# EAGLE design BEP2_rev1 (EAGLE 6.5.0)
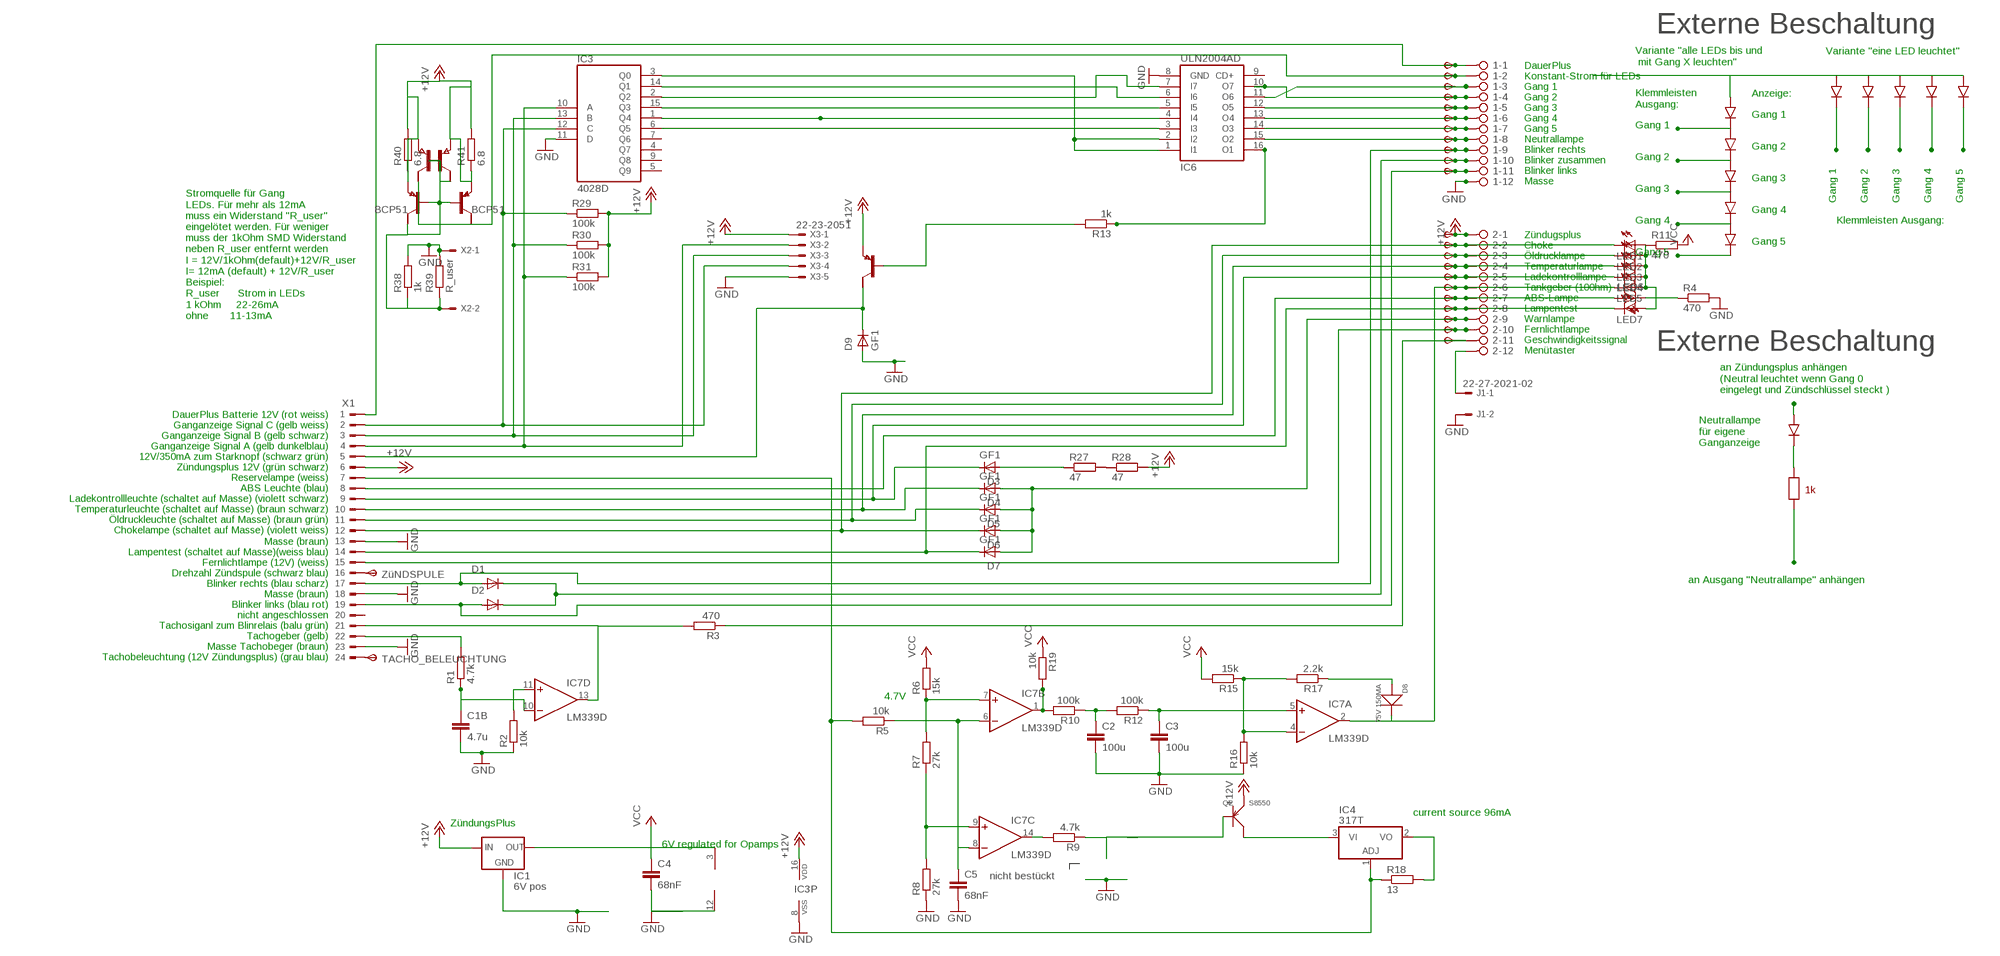
[diagram p0: schematic, sheet 1]

## Parts
1  2081-1132  [12-PIN]
2  2081-1132  [12-PIN]
C1B  4.7u  C-EUC0805K  [C0805K]
C2  100u  C-EUC1206K  [C1206K]
C3  100u  C-EUC1206K  [C1206K]
C4  68nF  C-EUC1206K  [C1206K]
C5  68nF  C-EUC1206K  [C1206K]
D1  GF1  [SMA-DO214AC]
D2  GF1  [SMA-DO214AC]
D3  GF1  [SMA-DO214AC]
D4  GF1  [SMA-DO214AC]
D5  GF1  [SMA-DO214AC]
D6  GF1  [SMA-DO214AC]
D7  GF1  [SMA-DO214AC]
D8  75V 150MA  SMD-DIODE-SWITCHING-75V-150MA(D1206)  [LED-1206]
D9  GF1  [SMA-DO214AC]
IC1  6V pos  78LXX  [78LXX]
IC3  4028D  [SO16]
IC4  317T  [TO220H]
IC6  ULN2004AD  [SO16]
IC7  LM339D  [SO14]
J1  22-27-2021-02  [6410-02]
LED1  LEDLD260  [LD260]
LED2  LEDLD260  [LD260]
LED3  LEDLD260  [LD260]
LED4  LEDLD260  [LD260]
LED5  LEDLD260  [LD260]
LED6  LEDLD260  [LD260]
LED7  LEDLD260  [LD260]
Q2  S8550  SMD-TRANSISTORS-PNP-25V-500MA-S8550(SOT-23)  [SOT-23]
Q3  BCP53T1  [SOT223]
R1  4.7k  R-EU_R0805  [R0805]
R2  10k  R-EU_R0805  [R0805]
R3  470  R-EU_R0805  [R0805]
R4  470  R-EU_R0805  [R0805]
R5  10k  R-EU_R0805  [R0805]
R6  15k  R-EU_R0805  [R0805]
R7  27k  R-EU_R0805  [R0805]
R8  27k  R-EU_R0805  [R0805]
R9  4.7k  R-EU_R0805  [R0805]
R10  100k  R-EU_R0805  [R0805]
R11  470  R-EU_R0805  [R0805]
R12  100k  R-EU_R0805  [R0805]
R13  1k  R-EU_R0805  [R0805]
R15  15k  R-EU_R0805  [R0805]
R16  10k  R-EU_R0805  [R0805]
R17  2.2k  R-EU_R0805  [R0805]
R18  13  R-EU_R1206  [R1206]
R19  10k  R-EU_R0805  [R0805]
R27  47  R-EU_V235/17_1MM  [V235/17_1MM]
R28  47  R-EU_V235/17_1MM  [V235/17_1MM]
R29  100k  R-EU_R0805  [R0805]
R30  100k  R-EU_R0805  [R0805]
R31  100k  R-EU_R0805  [R0805]
R38  1k  R-EU_R0805  [R0805]
R39  R_user  R-EU_R0805  [R0805]
R40  6.8  R-EU_R0805  [R0805]
R41  6.8  R-EU_R0805  [R0805]
T1  PNP2SM8  [SM8]
T13  BCP53T1  [SOT223]
T14  BCP53T1  [SOT223]
TACHO_BELEUCHTUNG  TPSP1_1MM  [P1_1.0MM]
TP1  TPSB1,27  [B1,27]
TP2  TPSB1,27  [B1,27]
TP3  TPSB1,27  [B1,27]
TP4  TPSB1,27  [B1,27]
TP5  TPSB1,27  [B1,27]
TP6  TPSB1,27  [B1,27]
TP7  TPSB1,27  [B1,27]
TP8  TPSB1,27  [B1,27]
TP9  TPSB1,27  [B1,27]
TP10  TPSB1,27  [B1,27]
TP11  TPSB1,27  [B1,27]
TP12  TPSB1,27  [B1,27]
TP16  TPSB1,27  [B1,27]
TP17  TPSB1,27  [B1,27]
TP18  TPSB1,27  [B1,27]
TP19  TPSB1,27  [B1,27]
TP21  TPSB1,27  [B1,27]
TP22  TPSB1,27  [B1,27]
TP23  TPSB1,27  [B1,27]
TP24  TPSB1,27  [B1,27]
TP25  TPSB1,27  [B1,27]
TP26  TPSB1,27  [B1,27]
X1  CON_BMW  [24-PIN]
X2  22-23-2021  [22-23-2021]
X3  22-23-2051  [22-23-2051]
ZüNDSPULE  TPSP1_1MM  [P1_1.0MM]

## Nets
+12V: 2.1 IC1.IN IC3.16(VDD) Q2.2(E) Q3.3(E) R28.2 R29.2 R30.2 R31.2 R40.1 R40.2 R41.1 R41.2 T1.1(B:E) T1.3(A:E) T13.3(E) T14.3(E) TP12.TP(PP) X1.6 X3.1
GND: 1.12 C1B.2 C2.2 C3.2 C4.2 C5.2 D9.A IC1.GND IC3.8(VSS) IC3.11(D) IC6.8(GND) IC7.12(P:GND) J1.2 R2.1 R4.2 R8.1 R16.1 R38.2 R39.2 X1.13 X1.18 X1.23 X2.1 X3.5
N$1: 2.9 D4.A D5.A D6.A D7.A TP24.TP(PP)
N$2: IC3.10(A) R31.1 X1.4 X3.2
N$3: IC3.13(B) R30.1 X1.3 X3.3
N$4: 2.7 LED6.A TP22.TP(PP) X1.8
N$6: IC6.16(O1) R13.1
N$7: IC7.11(D:+IN) R2.2
N$8: R27.2 R28.1
N$11: D9.K(C) Q3.2(C) X1.5
N$12: 2.2 D6.K(C) LED1.K(C) TP16.TP(PP) X1.12
N$13: 2.3 D5.K(C) LED2.K(C) TP17.TP(PP) X1.11
N$14: 2.4 D4.K(C) LED3.K(C) TP18.TP(PP) X1.10
N$15: IC4.1(ADJ) R5.2 R18.1 X1.7
N$16: C5.1 IC7.6(B:-IN) IC7.8(C:-IN) R5.1
N$17: IC3.12(C) R29.1 X1.2 X3.4
N$18: IC3.15(Q3) IC6.5(I5)
N$19: 2.8 D7.K(C) LED7.K(C) TP23.TP(PP) X1.14
N$20: 1.9 D1.A TP9.TP(PP) X1.17
N$21: 1.11 D2.A TP11.TP(PP) X1.19
N$22: 1.10 D1.K(C) D2.K(C) TP10.TP(PP)
N$23: R1.2 X1.22
N$24: C1B.1 IC7.10(D:-IN) R1.1
N$25: 1.6 IC6.13(O4) TP6.TP(PP)
N$26: 1.7 IC6.14(O3) TP7.TP(PP)
N$27: 2.11 R3.1 TP26.TP(PP)
N$28: 2.12 J1.1
N$29: IC4.2(VO) R18.2
N$30: IC7.9(C:+IN) R7.1 R8.2
N$31: IC7.14(C:OUT) R9.2
N$34: LED6.K(C) R4.1
N$35: IC4.3(VI) Q2.3(C)
N$36: Q2.1(B) R9.1
N$37: IC3.2(Q2) IC6.7(I7)
N$38: 1.3 IC6.11(O6) TP3.TP(PP)
N$39: 1.5 IC6.12(O5) TP5.TP(PP)
N$40: IC7.7(B:+IN) R6.1 R7.2
N$41: LED1.A LED2.A LED3.A LED4.A LED5.A LED7.A R11.1
N$42: X1.16 ZüNDSPULE.TP(PP)
N$43: Q3.1(B) R13.2
N$44: IC3.3(Q0) IC6.1(I1) IC6.2(I2)
N$45: C2.1 R10.1 R12.2
N$46: C3.1 IC7.5(A:+IN) R12.1
N$47: IC7.4(A:-IN) R15.1 R16.2 R17.2
N$48: IC7.13(D:OUT) R3.2 X1.21
N$49: D8.+ R17.1
N$50: IC3.1(Q4) IC6.4(I4)
N$52: 1.8 IC6.15(O2) TP8.TP(PP)
N$53: 2.10 TP25.TP(PP) X1.15
N$54: D3.A R27.1
N$55: 2.5 D3.K(C) LED4.K(C) TP19.TP(PP) X1.9
N$56: IC3.14(Q1) IC6.6(I6)
N$57: R38.1 R39.1 T1.2(B:B) T1.4(A:B) T1.6(A:C1) T13.1(B) T13.2(C) T14.1(B) X2.2
N$58: TACHO_BELEUCHTUNG.TP(PP) X1.24
N$59: 1.2 T1.8(B:C1) T14.2(C) TP2.TP(PP)
N$60: 2.6 D8.- IC7.2(A:OUT) LED5.K(C) TP21.TP(PP)
N$61: IC3.6(Q5) IC6.3(I3)
N$67: 1.4 IC6.10(O7) TP4.TP(PP)
N$69: 1.1 TP1.TP(PP) X1.1
N$580: IC7.1(B:OUT) R10.2 R19.2
VCC: C4.1 IC1.OUT IC7.3(P:V+) R6.2 R11.2 R15.2 R19.1
Unconnected: IC3.4(Q7) IC3.5(Q9) IC3.7(Q6) IC3.9(Q8) IC6.9(CD+) Q3.4(C/) T1.5(A:C) T1.7(B:C) T13.4(C/) T14.4(C/) X1.20

## Notes on the sheet
- Externe Beschaltung
- Variante "eine LED leuchtet"
- Variante "alle LEDs bis und
   mit Gang X leuchten"
- Anzeige:
- Klemmleisten
  Ausgang:
- Gang 1
- DauerPlus
  Konstant-Strom für LEDs
  Gang 1
  Gang 2
  Gang 3
  Gang 4
  Gang 5
  Neutrallampe
  Blinker rechts
  Blinker zusammen
  Blinker links
  Masse
- Gang 1
- Gang 2
- Gang 2
- Gang 3
- Gang 3
- Gang 1 | Gang 2 | Gang 3 | Gang 4 | Gang 5
- Gang 4
- Gang 4 | Klemmleisten Ausgang:
- Gang 5
- Gang 5
- Zündugsplus
  Choke
  Öldrucklampe
  Temperaturlampe
  Ladekontrolllampe
  Tankgeber (100hm)
  ABS-Lampe
  Lampentest
  Warnlampe
  Fernlichtlampe
  Geschwindigkeitssignal
  Menütaster
- Stromquelle für Gang
  LEDs. Für mehr als 12mA
  muss ein Widerstand "R_user"
  eingelötet werden. Für weniger
  muss der 1kOhm SMD Widerstand
  neben R_user entfernt werden
  I = 12V/1kOhm(default)+12V/R_user
  I= 12mA (default) + 12V/R_user
  Beispiel:
  R_user      Strom in LEDs
  1 kOhm     22-26mA
  ohne       11-13mA
- Externe Beschaltung
- an Zündungsplus anhängen
  (Neutral leuchtet wenn Gang 0
  eingelegt und Zündschlüssel steckt )
- Neutrallampe
  für eigene
  Ganganzeige
- DauerPlus Batterie 12V (rot weiss)
  Ganganzeige Signal C (gelb weiss)
  Ganganzeige Signal B (gelb schwarz)
  Ganganzeige Signal A (gelb dunkelblau)
  12V/350mA zum Starknopf (schwarz grün)
  Zündungsplus 12V (grün schwarz)
  Reservelampe (weiss)
  ABS Leuchte (blau)
  Ladekontrollleuchte (schaltet auf Masse) (violett schwarz)
  Temperaturleuchte (schaltet auf Masse) (braun schwarz)
  Öldruckleuchte (schaltet auf Masse) (braun grün)
  Chokelampe (schaltet auf Masse) (violett weiss)
- 1k
- an Ausgang "Neutrallampe" anhängen
- Masse (braun)
  Lampentest (schaltet auf Masse)(weiss blau)
  Fernlichtlampe (12V) (weiss)
  Drehzahl Zündspule (schwarz blau)
  Blinker rechts (blau scharz)
  Masse (braun)
  Blinker links (blau rot)
  nicht angeschlossen
  Tachosiganl zum Blinrelais (balu grün)
  Tachogeber (gelb)
  Masse Tachobeger (braun)
  Tachobeleuchtung (12V Zündungsplus) (grau blau)
- 4.7V
- current source 96mA
- ZündungsPlus
- 6V regulated for Opamps
- nicht bestückt

## Library data of the parts
1 2 = con WAGO BMW:2081-1132: WAGO SREW CLAMP
C1B C2-C5 = rcl:C-EU: CAPACITOR, European symbol
D1-D7 D9 = diode:GF1: DIODE
D8 = Seeed-Diode-2016:SMD-DIODE-SWITCHING-75V-150MA(D1206): 304040005; MPN: CD1206-S01575
IC1 = v-reg:78LXX: VOLTAGE REGULATOR
IC3 = 40xx:4028: BCD to decimal DECODER
IC4 = linear_BMW:*317: Positive VOLTAGE REGULATOR
IC6 = uln-udn:ULN2004A: DRIVER ARRAY
IC7 = linear:LM339: Low Power Low Offset Voltage Quad Comparators with open collector; LM139/LM239/LM339/LM2901/LM3302
J1 = con-molex:22-?-02: CONNECTOR wire to board 2.54 mm (.1 inch) pitch header; OC_FARNELL: unknown; OC_NEWARK: unknown
LED1-LED7 = led:LED: LED OSRAM: - CHIPLED LG R971, LG N971, LY N971, LG Q971, LY Q971, LO R971, LY R971 LH N974, LH R974 LS Q976, LO Q976, LY Q976 LO Q996 - Hyper CHIPLED LW Q18S LB Q993, LB Q99A, LB R99A - SideLED LS A670, LO A670, LY A670, LG A670, LP A670 LB A673, LV A673, LT A673, LW A673 LH A674 LY A675 LS A676, LA A676, LO A676, LY A676, LW A676 LS A679, LY A679, LG A679 - Hyper Micro SIDELED® LS Y876, LA Y876, LO Y876, LY Y876 LT Y87S - SmartLED LW L88C, LW L88S LB L89C, LB L89S, LG L890 LS L89K, LO L89K, LY L89K LS L896, LA L896, LO L896, LY L896 - TOPLED LS T670, LO T670, LY T670, LG T670, LP T670 LSG T670, LSP T670, LSY T670, LOP T670, LYG T670 LG T671, LOG T671, LSG T671 LB T673, LV T673, LT T673, LW T673 LH T674 LS T676, LA T676, LO T676, LY T676, LB T676, LH T676, LSB T676, LW T676 LB T67C, LV T67C, LT T67C, LS T67K, LO T67K, LY T67K, LW E67C LS E67B, LA E67B, LO E67B, LY E67B, LB E67C, LV E67C, LT E67C LW T67C LS T679, LY T679, LG T679 LS T770, LO T770, LY T770, LG T770, LP T770 LB T773, LV T773, LT T773, LW T773 LH T774 LS E675, LA E675, LY E675, LS T675 LS T776, LA T776, LO T776, LY T776, LB T776 LHGB T686 LT T68C, LB T68C - Hyper Mini TOPLED® LB M676 - Mini TOPLED Santana® LG M470 LS M47K, LO M47K, LY M47K Source: http://www.osram.convergy.de LUXEON: - LUMILED® LXK2-PW12-R00, LXK2-PW12-S00, LXK2-PW14-U00, LXK2-PW14-V00 LXK2-PM12-R00, LXK2-PM12-S00, LXK2-PM14-U00 LXK2-PE12-Q00, LXK2-PE12-R00, LXK2-PE12-S00, LXK2-PE14-T00, LXK2-PE14-U00 LXK2-PB12-K00, LXK2-PB12-L00, LXK2-PB12-M00, LXK2-PB14-N00, LXK2-PB14-P00, LXK2-PB14-Q00 LXK2-PR12-L00, LXK2-PR12-M00, LXK2-PR14-Q00, LXK2-PR14-R00 LXK2-PD12-Q00, LXK2-PD12-R00, LXK2-PD12-S00 LXK2-PH12-R00, LXK2-PH12-S00 LXK2-PL12-P00, LXK2-PL12-Q00, LXK2-PL12-R00 Source: www.luxeon.com KINGBRIGHT: KA-3528ASYC Source: www.kingbright.com
Q2 = Seeed-Transistor-2016:SMD-TRANSISTORS-PNP-25V-500MA-S8550(SOT-23): 305020006; MPN: S8550
Q3 = BCP53_:BCP53*
R1-R13 R15-R19 R27-R31 R38-R41 = rcl:R-EU_: RESISTOR, European symbol
T1 = PNP2SM8:PNP2SM8; OC_FARNELL: unknown; OC_NEWARK: unknown
T13 T14 = BCP53_:BCP53*; T: BCP51
TACHO_BELEUCHTUNG TP1-TP12 TP16-TP19 TP21-TP26 ZüNDSPULE = testpin_BMW:TPS: TEST PIN
X1 = con_BMW:CON_BMW: BMW CONNECTOR
X2 = con-molex:22-23-2021: .100" (2.54mm) Center Header - 2 Pin; MF: MOLEX; MPN: 22-23-2021; OC_FARNELL: 1462926; OC_NEWARK: 25C3832
X3 = con-molex:22-23-2051: .100" (2.54mm) Center Header - 5 Pin; MF: MOLEX; MPN: 22-23-2051; OC_FARNELL: 1462952; OC_NEWARK: 38C9178

## Board
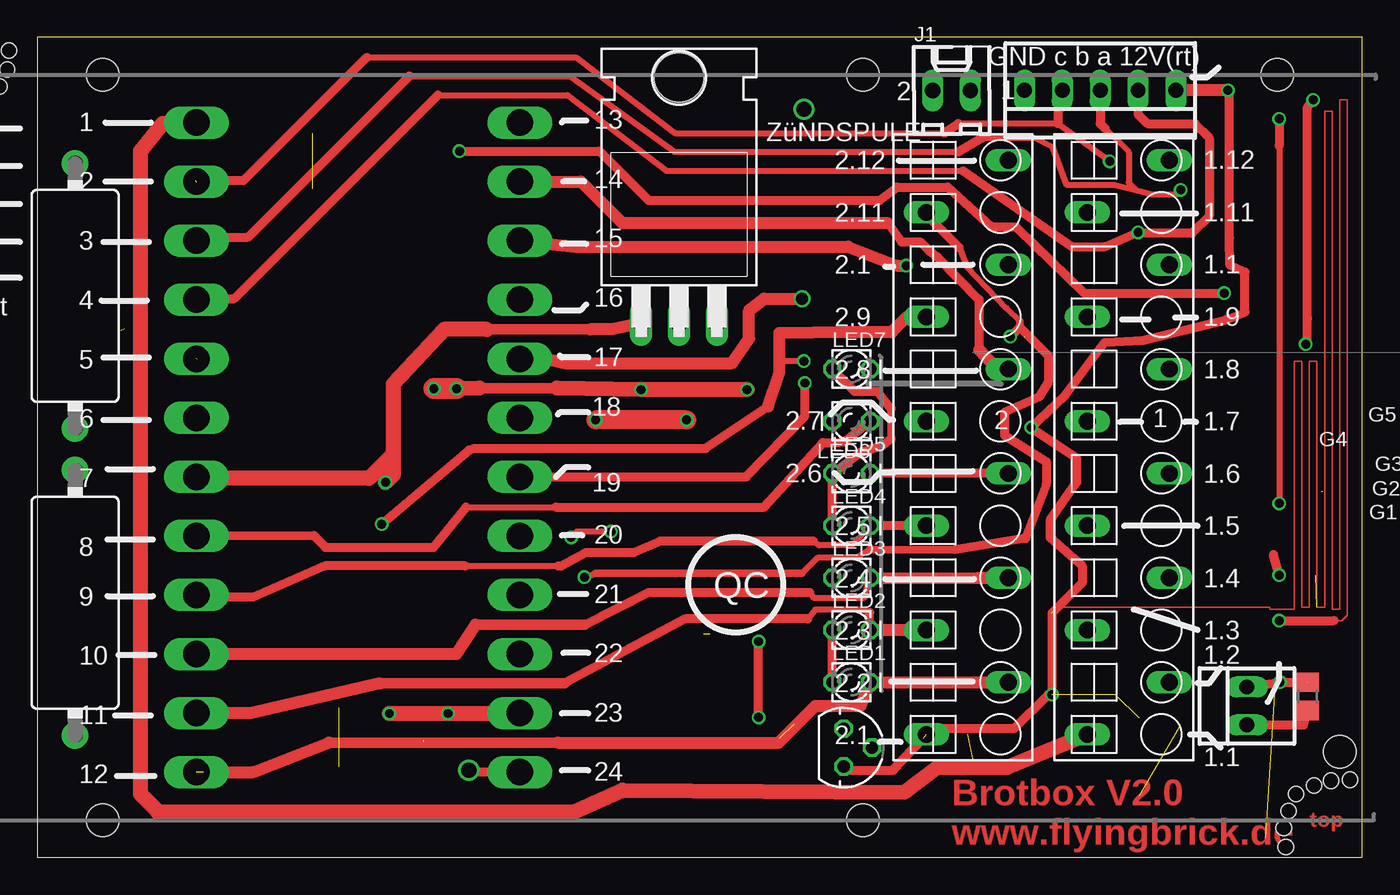
[diagram p1: board, top side]
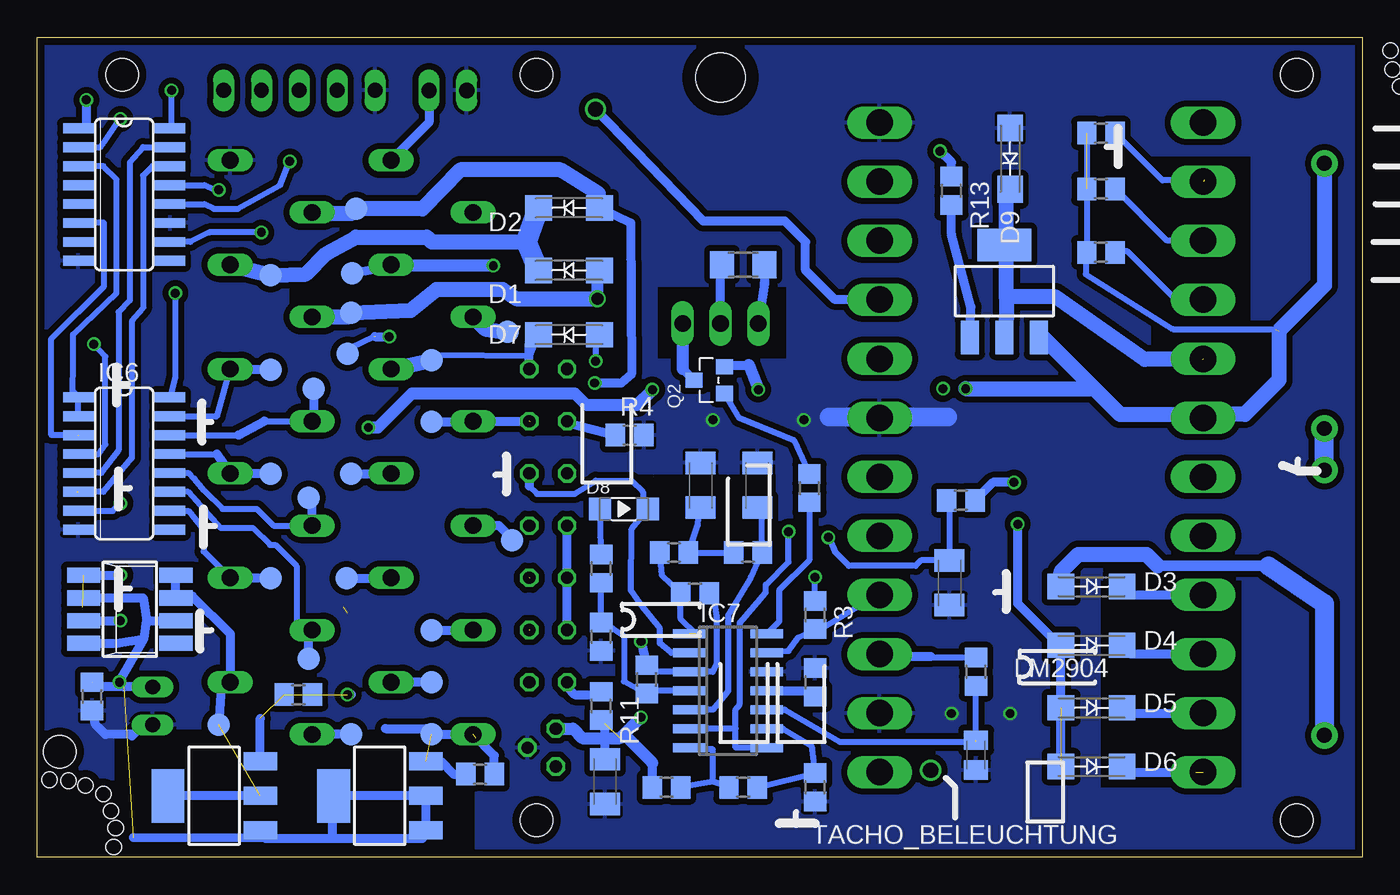
[diagram p2: board, bottom side, seen from below]

Size 88.89 x 55 mm. Coordinates in mm from the lower left corner, seen from the top.
Outline: 0,0 88.89,0 88.89,55 0,55 0,0
Copper layers (1*16): Top 0.035mm / dielectric 1.5mm / Bottom 0.035mm
Design rules "multi-cb_035um-cu *": minimum track width 6mil, minimum drill 12mil, track to track 16mil, track to pad 20mil, pad to pad 16mil, via to via 16mil, smd to smd 16mil, copper to edge 20mil, drill to drill 8mil, minimum pad ring 8mil, minimum via ring 6mil, stop-mask expansion 3mil, vias tented up to drill 0mil, thermal gap 8mil
Holes 2.18 mm at 4.39,52.5 55.39,52.5 4.39,2.5 55.39,2.5 83.19,52.5 87.39,7.1
Holes 1.02 mm at -6.16,50.36 -4.83,50.67 -3.56,50.93 -2.54,51.69 -1.91,54.1 88.07,5.21 86.8,5.14 85.66,4.83 83.95,3.11 83.63,1.97 83.76,0.7 84.45,4.25 -2.03,52.83
bRestrict: area 7.5,31.8 to 14.2,47; area 53.7,28.3 to 55.6,30.5; area 38.7,33.5 to 47.2,38.2; area 59.6,0.6 to 83.7,8.6; area 49.7,33.3 to 51.6,37.1; area 60.5,32.7 to 66.5,40; area 66.5,35.6 to 71.9,39.7; area 39.4,24.1 to 48.9,25.7; area 8.1,4.7 to 17.5,18.5

### Footprints (pad centres in the part's own frame; a part is rotated, then mirrored left to right if it is on the bottom)
12-PIN = drill 1.118 long: 1 19.25,-2.45; 2 15.75,3.05; 3 12.25,-2.45; 4 8.75,3.05; 5 5.25,-2.45; 6 1.75,3.05; 7 -1.75,-2.45; 8 -5.25,3.05; 9 -8.75,-2.45; 10 -12.25,3.05; 11 -15.75,-2.45; 12 -19.25,3.05
C0805K = smd 1.3 x 1.6: 1 -1,0; 2 1,0
C1206K = smd 1.5 x 2: 1 -1.5,0; 2 1.5,0
SMA-DO214AC = smd 1.8 x 1.7: A -2.05,0; K 2.05,0
LED-1206 = smd 1.5 x 1.5: + -1.6,0; - 1.6,0
78LXX = drill 0.813 octagon: GND 0,1.905; IN 1.27,0; OUT -1.27,0
SO16 = smd 0.66 x 2.032: 1 -4.445,-3.073; 2 -3.175,-3.073; 3 -1.905,-3.073; 4 -0.635,-3.073; 5 0.635,-3.073; 6 1.905,-3.073; 7 3.175,-3.073; 8 4.445,-3.073; 9 4.445,3.073; 10 3.175,3.073; 11 1.905,3.073; 12 0.635,3.073; 13 -0.635,3.073; 14 -1.905,3.073; 15 -3.175,3.073; 16 -4.445,3.073
TO220H = drill 1.118 long: 1 -2.54,-10.16; 2 0,-10.16; 3 2.54,-10.16 | hole 3.302: 0,6.326
SO14 = smd 0.6 x 2.2: 1 -3.81,-2.6; 2 -2.54,-2.6; 3 -1.27,-2.6; 4 0,-2.6; 5 1.27,-2.6; 6 2.54,-2.6; 7 3.81,-2.6; 8 3.81,2.6; 9 2.54,2.6; 10 1.27,2.6; 11 0,2.6; 12 -1.27,2.6; 13 -2.54,2.6; 14 -3.81,2.6
6410-02 = drill 1.016 long: 1 1.27,0; 2 -1.27,0
LD260 = drill 0.813 octagon: A -1.27,0; K 1.27,0
SOT-23 = smd 1.016 x 1.143: 1 -0.889,-1.016; 2 0.889,-1.016; 3 0,1.016
SOT223 = smd 1.219 x 2.235: 1 -2.311,-3.099; 2 0,-3.099; 3 2.311,-3.099 | smd 3.6 x 2.2: 4 0,3.099
R0805 = smd 1.3 x 1.5: 1 -0.95,0; 2 0.95,0
R1206 = smd 1.6 x 1.803: 1 -1.422,0; 2 1.422,0
V235/17_1MM = drill 1 pad 1.778: 1 -8.89,0; 2 8.89,0
SM8 = smd 1.016 x 2.235: 1 -2.286,-3.099; 2 -0.762,-3.099; 3 0.762,-3.099; 4 2.286,-3.099; 5 2.286,3.099; 6 0.762,3.099; 7 -0.762,3.099; 8 -2.286,3.099
P1_1.0MM = drill 1.016: TP 0,0
B1,27 = smd 1.5 x 1.5: TP 0,0
24-PIN = drill 1.778 long: 1 -21.78,-10.85; 2 -17.82,-10.85; 3 -13.86,-10.85; 4 -9.9,-10.85; 5 -5.94,-10.85; 6 -1.98,-10.85; 7 1.98,-10.85; 8 5.94,-10.85; 9 9.9,-10.85; 10 13.86,-10.85; 11 17.82,-10.85; 12 21.78,-10.85; 13 -21.78,10.85; 14 -17.82,10.85; 15 -13.86,10.85; 16 -9.9,10.85; 17 -5.94,10.85; 18 -1.98,10.85; 19 1.98,10.85; 20 5.94,10.85; 21 9.9,10.85; 22 13.86,10.85; 23 17.82,10.85; 24 21.78,10.85
22-23-2021 = drill 1 long: 1 -1.27,0; 2 1.27,0
22-23-2051 = drill 1 long: 1 -5.08,0; 2 -2.54,0; 3 0,0; 4 2.54,0; 5 5.08,0

### Placement (x,y rotation side)
1  72.9,27.5 270 top
2  62.1,27.5 270 top
C1B  25.91,6.86 270 bottom
C2  44.39,24.96 90 bottom
C3  40.58,24.96 90 bottom
C4  50.8,5.08 270 bottom
C5  27.69,18.41 270 bottom
D1  53.21,39.37 180 bottom
D2  53.21,43.56 180 bottom
D3  18.16,18.16 0 bottom
D4  18.16,14.22 0 bottom
D5  18.16,10.03 0 bottom
D6  18.16,6.1 0 bottom
D7  53.21,35.05 180 bottom
D8  49.53,23.37 0 bottom
D9  23.62,46.86 270 bottom
IC1  54.1,7.37 270 top
IC3  83.06,44.45 270 bottom
IC4  43.05,45.97 0 top
IC6  83.06,26.42 270 bottom
IC7  42.54,11.18 270 bottom
J1  61.34,51.44 0 top
LED1  54.61,11.75 0 top
LED2  54.61,15.25 0 top
LED3  54.61,18.75 0 top
LED4  54.61,22.25 0 top
LED5  54.61,25.75 0 top
LED6  54.61,29.25 180 top
LED7  54.61,32.75 0 top
Q2  43.81,32 90 bottom
Q3  24,37.97 0 bottom
R1  25.91,12.45 90 bottom
R2  36.7,11.75 270 bottom
R3  36.7,16.26 270 bottom
R4  49.15,28.32 0 bottom
R5  26.92,23.94 0 bottom
R6  46.67,4.7 180 bottom
R7  41.53,4.7 180 bottom
R8  36.7,4.7 90 bottom
R9  37.08,24.77 270 bottom
R10  46.16,20.45 180 bottom
R11  51.05,10.16 270 bottom
R12  41.21,20.45 180 bottom
R13  27.56,44.7 270 bottom
R15  48.01,11.94 90 bottom
R16  51.05,14.8 90 bottom
R17  51.05,19.37 270 bottom
R18  41.53,39.75 180 bottom
R19  44.77,17.72 180 bottom
R27  2.54,17.08 90 top
R28  2.54,37.66 90 top
R29  17.53,48.58 180 bottom
R30  17.53,44.83 180 bottom
R31  17.53,40.58 180 bottom
R38  85.22,10.79 270 bottom
R39  85.22,10.79 270 top
R40  59.18,5.59 0 bottom
R41  71.37,10.92 0 bottom
T1  82.68,16.64 270 bottom
T13  65.91,4.13 90 bottom
T14  77.03,4.13 90 bottom
TACHO_BELEUCHTUNG  28.96,5.84 0 bottom
TP1  67.82,8.26 0 bottom
TP2  76.71,8.89 0 bottom
TP3  70.68,13.34 0 bottom
TP4  73.22,18.73 0 bottom
TP5  70.68,24.13 0 bottom
TP6  73.22,25.72 0 bottom
TP7  70.36,31.43 0 bottom
TP8  73.22,32.7 0 bottom
TP9  67.82,36.51 0 bottom
TP10  73.22,39.05 0 bottom
TP11  67.5,43.5 0 bottom
TP12  62.42,8.26 0 bottom
TP16  62.42,11.75 0 bottom
TP17  62.42,15.24 0 bottom
TP18  68.14,18.73 0 bottom
TP19  57.02,21.27 0 bottom
TP21  67.82,25.72 0 bottom
TP22  62.42,29.21 0 bottom
TP23  62.42,33.34 0 bottom
TP24  57.34,35.24 0 bottom
TP25  67.75,39.18 0 bottom
TP26  68.07,33.78 0 bottom
X1  21.52,27.5 270 top
X2  81.15,10.16 90 top
X3  71.31,51.44 180 top
ZüNDSPULE  51.43,50.16 0 bottom

### Tracks (layer width: path | path; a pad name or v marks a point on that pad's centre or on a via)
+12V  (via drill 0.6)  (9 unrouted)
  Top 0.1: v83.31,15.88 87.5,15.88 87.88,16.26 87.88,50.8 87.38,50.8 87.38,16.64 86.87,16.64 86.87,50.04 86.36,50.04 86.36,16.76 85.85,16.76 85.85,33.27 85.34,33.27 85.34,16.76 84.84,16.76 84.84,33.27 84.33,33.27 84.33,16.64 82.68,16.64 82.68,16.76 68.33,16.76
  Top 0.406: IC1.IN 54.36,6.1 54.61,5.84 | 59.44,8 59.4,8
  Top 0.61: v79.88,51.44 79.98,51.33 79.98,41.53 80.01,39.73 81.03,39.24 81.03,36.58 79.76,36.07 74.17,34.67 71.63,34.54 68.96,30.99 v66.68,28.83 69.72,26.8 69.72,25.15 67.95,22.61 67.95,21.46 70.1,19.56 70.1,18.41 68.07,16.38 v68.07,10.92 67.82,10.92 65.53,8.64 60.04,8.64 2.1 | 54.61,5.84 57.4,5.84 59.44,8 | v40.51,31.37 39.75,31.37 | v83.31,18.92 82.93,20.32 | v83.31,15.88 87,15.88
  Top 0.711: 34.86,31.47 29.66,31.47
  Top 0.813: v79.88,51.44 X3.1
  Top 1.016: v47.62,31.37 v40.51,31.37 34.86,31.47 | 29.66,31.47 v28.13,31.43
  Top 1.422: v28.13,31.43 v26.61,31.43
  Bottom 0.406: IC3.16 79.88,48.9 v79.88,51.44 | R29.2 R31.2 18.54,40.58 18.54,39.12 12.7,35.43 5.84,35.43
  Bottom 0.61: R40.2 58.23,6.83 2.1 TP12.TP 62.8,8.64 65.53,8.64 | v68.07,10.92 67.82,10.92 | Q2.2 42.67,33.02 41.15,33.02 | T13.3 61.81,6.44 60.96,5.59 R40.1 | T1.1 v83.31,18.92 | T14.3 73.93,9.32 | T1.3 v83.31,15.88
  Bottom 0.813: v66.68,28.83 66.04,28.83 63.75,31.11 52.83,31.11 52.07,30.35 48.64,30.35 v47.62,31.37 | 41.15,33.02 v40.51,31.37
  Bottom 1.016: R28.2 2.54,38.35 5.59,35.31 5.59,32 7.87,29.72 10.44,29.72 X1.6 10.94,29.72 16.26,29.72 17.97,31.43 | v26.61,31.43 17.97,31.43 | Q3.3 21.41,34.87 17.97,31.43
GND  (via drill 0.6)
  Top 0.61: X2.1 84.96,8.89 R39.2
  Top 1.27: v43.56,29.34 v37.46,29.34
  Bottom 0.61: 82.42,8.26 84.33,8.26 84.96,8.89 R39.2
  Bottom 1.27: 27.81,29.53 35.75,29.53
  other vias: 23.62,9.65 27.56,9.65
  pour Bottom: 0,55.24 88.77,55.24 88.77,0 0,0
  pour Bottom: 0,55.37 88.77,55.37 88.77,0.13 0,0.13
N$1  (via drill 0.6)  (2 unrouted)
  Top 0.406: v51.43,33.27 49.91,33.27 49.78,32.51
  Top 0.61: v23.11,22.35 28.96,27.3 29.34,27.43 44.83,27.43 49.02,30.23
  Top 0.813: 49.02,30.23 49.78,32.51 49.78,35.18 54.29,35.24 TP24.TP 58.35,36.25 2.9
  Bottom 0.406: D7.A 51.43,34.78 v51.43,33.27
  Bottom 0.61: v23.11,22.35 23.11,17.02 20.32,14.22 D4.A D6.A
  Bottom 1.016: 57.66,35.24 58.79,35.42 58.82,35.42 2.9
N$2  (via drill 0.6)
  Top 0.406: 26.86,51.12 35.56,51.12 42.23,46.04 62.1,46.04
  Top 0.61: X1.4 10.74,37.47 13.21,37.47 26.86,51.12 | 62.1,46.04 69.41,40.96 71.63,40.96 v73.85,41.91 73.91,41.85 77.47,41.85 78.61,42.99 78.61,48.26 77.66,49.21 74.48,49.21 73.85,49.85 X3.2
  Bottom 0.406: v73.85,41.91 77.34,41.91 78.61,41.27 IC3.10 | X1.4 12.51,37.4 15.75,40.64 16.51,40.64 R31.1
N$3  (via drill 0.6)
  Top 0.406: 24.96,52.39 35.75,52.39 42.73,47.31 61.79,47.31 | 63.37,48.26 66.87,48.26 68.14,47.62 69.09,45.09 72.26,45.09 73.76,44.71 | v76.71,44.77 76.39,44.45 74.8,44.45 73.76,44.71 | 71.63,48.9 73.22,47.31 73.22,45.25 73.76,44.71
  Top 0.61: X1.3 10.9,41.59 14.16,41.59 24.96,52.39 | 61.79,47.31 63.37,48.26 | X3.3 71.31,49.21 71.63,48.9
  Bottom 0.406: IC3.13 77.66,45.09 77.03,44.77 v76.71,44.77 | X1.3 13.1,41.36 R30.1
N$4  (1 unrouted)
  Top 0.406: 28.77,23.5 34.8,23.5
  Top 0.61: X1.8 18.54,21.59 19.33,20.8 26.58,20.8 28.77,23.5 | 34.8,23.5 48.77,23.5 52.7,27.81 53.47,27.81 54.17,27.88 55.82,29.21
  Bottom 0.61: TP22.TP 59.69,29.21 2.7 LED6.A
N$5
  Top 1.016: 23.62,9.65 32.51,9.65
N$6  (via drill 0.6)
  Top 0.61: v28.32,47.37 37.72,47.37 41.02,44.07 56.52,44.07 57.66,44.96 61.09,44.96 64.01,42.29 65.66,42.29 65.79,42.16 70.23,37.85 v79.63,37.85
  Bottom 0.406: v79.63,37.85 79.63,32.23 IC6.16
  Bottom 0.61: R13.1 27.56,46.61 v28.32,47.37
N$7
  Bottom 0.61: IC7.11 36.83,11.18 R2.2
N$8
  Bottom 1.27: R27.2 R28.1
N$11  (1 unrouted)
  Bottom 1.016: 10.71,33.4 14.6,33.4 20.57,37.59 23.88,37.59 | 23.88,37.59 23.88,36.27 Q3.2 | 23.88,37.59 23.88,44.05 D9.K
N$12  (1 unrouted)
  Top 0.711: 19.56,7.7 34.92,7.7
  Top 0.813: X1.12 14.48,5.71 19.56,7.7 | 34.92,7.7 49.72,7.7 49.72,7.69 52.2,10.16 55.24,10.16 LED1.K 2.2
  Bottom 0.61: TP16.TP 2.2 | D6.K 15.73,5.71 11.18,5.71
N$13  (1 unrouted)
  Top 0.406: 55.83,16.43 55.37,16.61 52.2,16.61 51.69,16
  Top 0.61: 55.83,15.24 55.83,16.43 | 51.69,16 43.5,16 35.38,11.67
  Top 0.711: 35.38,11.67 23,11.67
  Top 0.813: 2.3 55.83,15.24 | 23,11.67 14.32,9.68 X1.11
  Bottom 0.61: TP17.TP 2.3 | D5.K 15.76,9.68 X1.11
N$14  (1 unrouted)
  Top 0.406: 51.82,17.78 52.07,17.42 55.5,17.42 55.82,18.73
  Top 0.61: 36.7,15.61 41.02,17.78 51.82,17.78
  Top 0.711: 29.4,15.61 36.7,15.61
  Top 0.813: X1.10 10.69,13.65 28.13,13.65 29.4,15.61 | 55.82,18.73 63.07,18.75 2.4
  Bottom 0.61: TP18.TP 65.17,18.73 2.4 | D4.K 15.54,13.65 11.18,13.65 11.16,13.64 X1.10
N$15  (via drill 0.6)
  Top 0.711: 37.08,35.41 30.16,35.41
  Top 0.813: IC4.1 38.61,35.43 37.08,35.41
  Top 1.016: 30.16,35.41 27.28,35.41 23.88,31.75 23.88,27.04 | 23.88,27.04 22.26,25.42 10.77,25.42 X1.7 | 23.88,27.04 23.88,25.65 v23.37,25.15
  Bottom 0.61: R18.1 40.11,38.51 IC4.1 | v23.37,25.15 24.77,25.15 R5.2
N$16  (via drill 0.6)
  Top 0.406: v38.48,21.84 36.2,21.84 v35.81,21.46
  Bottom 0.406: 42.04,8.64 42.04,7.37 IC7.8 | 42.04,8.64 IC7.6 | 42.04,8.64 42.04,9.91 41.76,10.29 41.76,15.75 40,17.78 40,18.29 38.48,19.81 v38.48,21.84 | v35.81,21.46 35.69,21.21 35.38,20.5 34.44,19.56 29.97,19.56 29.61,19.91 C5.1 27.69,23.94 R5.1
N$17  (via drill 0.6)  (1 unrouted)
  Top 0.406: 22.1,53.66 36.13,53.66 42.8,48.58 60.83,48.58 | v71.95,46.67 68.45,49.21 61.79,49.21
  Top 0.61: X1.2 10.76,45.4 13.84,45.4 22.1,53.66 | 60.83,48.58 61.79,49.21 | X3.4 68.45,51.44 68.45,49.21
  Bottom 0.406: IC3.12 77.66,43.81 77.03,43.5 75.44,43.5 72.58,45.09 v71.95,46.67 | 10.59,45.4 13.4,45.4 R29.1
N$18
  Bottom 0.406: IC3.15 81.79,47.62 82.68,46.61 82.68,37.34 83.44,36.58 83.44,27.3 84.58,25.78 IC6.5
N$19
  Top 0.61: 57.02,42.55 57.98,41.27 59.25,41.27 59.88,40.64 60.39,40.26 63.18,37.4 63.18,34.04 | 64.15,33.02 2.8
  Top 0.813: X1.14 36.47,45.32 39.24,42.55 57.02,42.55 | 63.18,34.04 64.15,33.02
  Bottom 0.406: 62.27,33.19 61.93,33.7 55.82,33.66 D7.K
  Bottom 0.61: LED7.K 55.88,34.44 D7.K
  Bottom 1.016: 2.8 TP23.TP 62.27,33.19
N$20  (via drill 0.81)
  Top 0.813: X1.17 34.12,33.44 35.43,33.15 46.61,33.15 47.75,34.8 47.75,36.7 48.77,37.47 v51.31,37.47
  Bottom 0.61: 51.31,39.23 D1.A
  Bottom 0.813: v51.31,37.47 51.31,39.23
  Bottom 1.016: 1.9 68.08,36.25 TP9.TP 63.83,36.69 62.1,38.1 57.66,38.1 56.77,37.47 v51.31,37.47
N$21  (via drill 0.6)  (1 unrouted)
  Top 0.61: X1.19 47.55,25.52 | 47.56,25.53 51.5,29.59 v51.5,31.81
  Bottom 0.61: D2.A 49.09,42.55 49.02,32.38 49.72,31.81 v51.5,31.81
  Bottom 1.016: D2.A 51.27,44.54 53.78,46.1 60.51,46.1 63.06,43.5 TP11.TP 67.82,43.18 69.69,43.18 1.11
N$22
  Bottom 1.016: 1.10 TP10.TP 70.87,39.12 69.48,40.51 67.5,41.59 62.74,41.59 62.42,41.27 56.05,41.27
  Bottom 1.422: D1.K 56.05,41.27 D2.K
N$23
  Bottom 0.406: R1.2 28.96,13.4 28.96,13.46
  Bottom 0.61: 28.96,13.46 32.37,13.46 X1.22
N$24  (1 unrouted)
  Bottom 0.406: IC7.10 38.73,9.91 35.05,7.75 25.91,7.75 R1.1
N$25
  Bottom 0.406: IC6.13 76.84,27.05
  Bottom 0.61: TP6.TP 75.92,25.72 1.6 76.84,27.05
N$26
  Bottom 0.406: 73.66,29.25 1.7 | IC6.14 75.4,28.32
  Bottom 0.61: TP7.TP 70.36,29.34 1.7 | 75.4,28.32 73.66,29.25
N$27  (via drill 0.6)  (1 unrouted)
  Top 0.406: 65.91,35.94 65.02,36.83 62.36,39.62 61.85,40.89 | 55.82,20.64 54.99,20.09 52.32,20.09 51.31,19.05 | v36.7,18.8 37.47,19.05 37.46,19.06
  Top 0.508: 65.91,35.94 65.91,35.56 | 61.59,20.64 55.82,20.64 | 51.31,19.05 38.73,19.05 37.46,19.06
  Top 0.61: 61.59,20.64 66.29,21.4 67.69,25.02 67.69,26.54 64.9,28.32 64.9,29.84 67.18,30.86 67.82,31.88 67.82,33.66 65.91,35.56 v65.28,34.92 | 2.11 59.65,43.09 61.85,40.89
  Bottom 0.406: TP26.TP 67.82,34.16 66.29,34.92 | R3.1 v36.7,18.8
  Bottom 0.61: 66.23,34.92 v65.28,34.92
N$28
  Bottom 0.61: J1.1 62.61,49.29 2.12
N$29
  Bottom 0.61: IC4.2 43.05,39.65 R18.2
N$30
  Bottom 0.406: R7.1 R8.2 36.96,7.49 38.87,8.64 IC7.9
N$31
  Bottom 0.406: R9.2 37.08,19.94 39.12,17.91 39.12,15.81 IC7.14
N$33
  Bottom 0.61: 81.03,8.89 81.79,8.89 82.55,8.13
N$34
  Bottom 0.61: LED6.K 53.19,29.12 R4.1
N$35
  Bottom 0.61: 45.59,32.77 Q2.3
  Bottom 0.813: IC4.3 45.59,32.77
N$36
  Bottom 0.406: R9.1 38.1,27.94 41.78,29.46 Q2.1
N$37  (via drill 0.6)
  Top 0.406: 83.31,47.75 v83.31,23.75
  Top 0.61: v83.31,49.53 83.31,47.75
  Bottom 0.406: IC3.2 84.65,47.62 v83.31,49.53 | IC6.7 83.82,23.24 v83.31,23.75
N$38
  Bottom 0.406: 1.3 70.48,15.25 71.5,15.76 71.5,19.56 72.9,20.95 73.28,20.95 74.42,22.1 76.58,22.1 78.74,24.51 IC6.11
  Bottom 0.61: TP3.TP 70.68,15.02 1.3
N$39
  Bottom 0.406: 1.5 73.04,22.25 74.16,23.37 76.45,23.37 77.72,24.64 78.36,25.4 78.74,25.78 IC6.12
  Bottom 0.61: 1.5 70.45,23.9 TP5.TP
N$40
  Bottom 0.406: R7.2 43.56,5.08 | 43.56,5.08 43.56,7.24 44.64,7.24 IC7.7 | 43.56,5.08 R6.1
N$41
  Top 0.508: 57.28,28.07 57.28,30.1
  Top 0.61: LED1.A LED2.A | LED4.A LED5.A 55.24,27.18 56.77,27.69 57.28,28.07 | 57.28,30.1 56.39,31.24 54.85,31.24 LED7.A
  Bottom 0.61: LED1.A 53.34,11.43 52.83,10.92 51.25,10.92 R11.1 | LED2.A LED3.A LED4.A
N$42
  Bottom 0.61: X1.16 35.37,37.4 37.34,39.37 37.34,41.27 38.73,42.67 44.2,42.67 ZüNDSPULE.TP
N$43
  Bottom 0.61: Q3.1 26.24,36.91 27.56,41.78 R13.2
N$44
  Bottom 0.406: IC6.2 IC6.1 86.51,31.27 86.49,33.15 86.49,35.05 83.57,37.85 83.57,45.47 84.45,46.35 IC3.3
N$45
  Bottom 0.406: R12.2 R10.1 44.58,22.25 C2.1
N$46
  Bottom 0.406: IC7.5 43.54,9.91 42.54,11.16 42.54,16.26 41.02,18.79 R12.1 40.26,23.27 C3.1
N$47
  Bottom 0.406: IC7.4 47.37,11.18 R15.1 49.53,11.81 49.53,14.86 50.29,15.37 R16.2 R17.2
N$48
  Bottom 0.406: IC7.13 38.55,13.84 38.48,13.84 37.85,14.73 R3.2 36.13,15.43 33.53,17.02 32.95,17.02 X1.21
N$49
  Bottom 0.406: R17.1 51.05,20.7 D8.+
N$50  (via drill 0.6)
  Top 0.406: v85.09,34.42 85.15,34.16 85.2,34.47
  Top 0.61: 85.2,34.47 85.22,36.13 85.22,50.29 v85.6,50.8
  Bottom 0.406: IC6.4 84.77,27.05 84.33,27.69 84.33,33.59 v85.09,34.42
  Bottom 0.61: v85.6,50.8 85.6,48.9 IC3.1
N$52
  Bottom 0.406: 76,32.7 1.8 76.82,29.59 IC6.15
  Bottom 0.61: TP8.TP 75.9,32.7 1.8
N$53  (via drill 0.6)
  Top 0.813: X1.15 36.07,40.96 54.4,40.96 57.66,39.69 v58.29,39.69
  Bottom 0.61: TP25.TP 65.09,39.69
  Bottom 0.813: v58.29,39.69 65.09,39.69 2.10
N$54
  Bottom 0.711: 13.72,19.56 6.29,19.56
  Bottom 1.016: D3.A 20.21,19.16 19.05,20.32 14.48,20.32 13.72,19.56
  Bottom 1.27: 6.29,19.56 2.54,17.02 R27.1
N$55
  Top 0.406: LED4.K 54.67,20.93 52.45,20.93 52.07,21.21 | 34.96,19.53 28.92,19.53 28.7,19.56
  Top 0.61: 2.5 LED4.K | 52.07,21.21 41.81,21.21 40,20.45 36.83,20.45 35.15,19.53 34.96,19.53 | X1.9 10.81,17.46 14.48,17.46 19.3,19.56 28.7,19.56
  Bottom 0.61: TP19.TP 57.02,21.36 57.91,22.25 2.5 | D3.K 15.55,17.6 X1.9
N$56  (1 unrouted)
  Bottom 0.406: IC3.14 81.15,46.35 81.79,45.72 81.79,36.83 82.55,35.94 82.55,26.8 84.45,24.51 86.23,24.51
N$57  (via drill 0.6)  (2 unrouted)
  Top 0.61: X2.2 v83.38,11.75 84.96,11.75
  Bottom 0.61: T13.1 63.14,1.5 | 82.42,1.33 73.53,1.27 73.3,1.5 T14.1 73.38,1.27 69.09,1.27 | 69.09,4.13 T13.2 T13.1 | 69.09,1.27 63.04,1.27 T13.1 | 69.09,1.27 69.09,3.17 | T1.2 81.79,17.4 81.53,15.88 | 81.53,15.88 T1.6 | T1.4 83.57,14.35 81.73,14.67 | 81.73,14.67 81.53,15.88 | 81.73,14.67 v83.38,11.75 83.06,11.43 | X2.2 83.06,11.43 | 83.06,11.43 84.9,11.43 R39.1
N$58
  Top 0.61: X1.24 29.34,5.72 TACHO_BELEUCHTUNG.TP
N$59  (1 unrouted)
  Bottom 0.61: T14.2 79.57,4.13 | TP2.TP 76.58,10.92 76.58,11.55 1.2 75.95,14.99 78.49,17.53 79.63,17.53 79.63,18.92 T1.8
N$60
  Top 0.61: 2.6 LED5.K
  Bottom 0.406: D8.- 49.01,22.04 49.07,17.91 48.26,16.76 47.12,15.37 47.12,14.35 46.35,13.72 IC7.2 | 55.88,24.89 55.37,24.38 52.83,24.38 51.43,25.27 49.02,25.27 48.26,24.51 48.26,23.19
  Bottom 0.61: TP21.TP 65.19,25.72 2.6 | LED5.K 55.88,24.89 | 48.26,23.19 D8.-
N$61  (1 unrouted)
  Bottom 0.406: 86.11,28.32 87.95,28.32 87.95,34.8 84.4,38.29 84.4,42.55 IC3.6
N$67
  Bottom 0.406: IC6.10 78.74,23.24 77.72,21.97 77.72,20.53 1.4
  Bottom 0.61: TP4.TP 75.93,18.73 1.4
N$69
  Top 1.016: X1.1 8.38,49.21 6.92,47.37 6.92,4.25 8.13,3.05 | 8.06,3.05 8.13,3.05 | 8.13,3.05 36,3.05 39.24,4.51 58.17,4.38 60.39,6.03 65.05,6.03 1.1
  Bottom 0.61: TP1.TP 1.1
N$580  (1 unrouted)
  Bottom 0.406: 44.7,14.99 45.72,16 45.72,17.21 R19.2 46.99,18.92 R10.2
VCC  (via drill 0.6)  (1 unrouted)
  Top 0.61: v48.39,9.4 v48.39,14.48
  Bottom 0.406: R19.1 43.5,17.21 43.33,16.13 43.33,12.95 43.56,12.45 IC7.3 47.37,12.45 47.88,12.95 47.95,12.95 R15.2
  Bottom 0.61: v48.39,14.48 R15.2 | R6.2 47.62,6.35 | C4.1 50.8,8.96 R11.2
  Bottom 0.813: IC1.OUT 52.96,8.64 52.32,8 49.78,8 49.53,8.26 | 49.53,8.26 v48.39,9.4 | 47.62,6.35 49.53,8.26

### Text on the board
Top: top | Brotbox V2.0 / www.flyingbrick.de
tPlace: G5 | G4 | G3 | G2 | G1 | QC
tNames: GND c b a 12V(rt) | GND / c / b / a | 12V rt | 18 | 19 | 2.7 / 2.6 | 8 | 1.12 / 1.11 / 1.1 / 1.9 / 1.8 / 1.7 / 1.6 / 1.5 / 1.4 / 1.3 | 1.2 | 1.1 | 1 / 2 / 3 / 4 / 5 / 6 / 7 / / 9 / 10 / 11 / 12 | 2.12 / 2.11 / 2.1 / 2.9 / 2.8 / / / 2.5 / 2.4 / 2.3 / 2.2 / 2.1 | 13 / 14 / 15 / 16 / 17 / / / 20 / 21 / 22 / 23 / 24
bNames: 3x | LM2904
tStop: Brotbox V2.0 / www.flyingbrick.de
tDocu: +12v